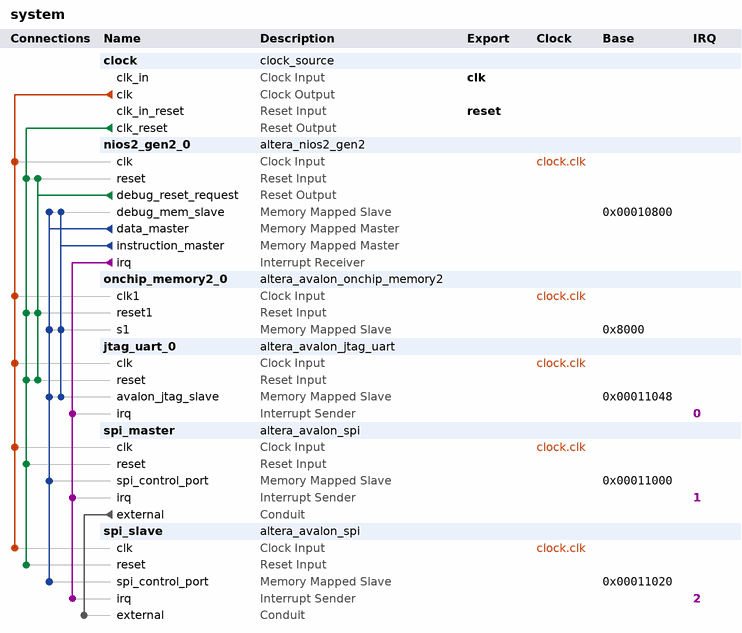
[diagram p0: system contents]
# Platform Designer (Qsys) system system, Cyclone IV E EP4CE115F29C7
# Parameters at their usual value, and those the tool derives, are not listed.
package require -exact qsys 18.1
create_system system
set_project_property DEVICE_FAMILY {Cyclone IV E}
set_project_property DEVICE EP4CE115F29C7

add_instance clock clock_source 18.1
set_instance_parameter_value clock clockFrequency 50000000

add_instance nios2_gen2_0 altera_nios2_gen2 18.1
set_instance_parameter_value nios2_gen2_0 dcache_size 2048
set_instance_parameter_value nios2_gen2_0 exceptionSlave onchip_memory2_0.s1
set_instance_parameter_value nios2_gen2_0 icache_size 4096
set_instance_parameter_value nios2_gen2_0 impl Tiny
set_instance_parameter_value nios2_gen2_0 resetSlave onchip_memory2_0.s1

add_instance onchip_memory2_0 altera_avalon_onchip_memory2 18.1
set_instance_parameter_value onchip_memory2_0 dataWidth 32
set_instance_parameter_value onchip_memory2_0 dualPort false
set_instance_parameter_value onchip_memory2_0 initMemContent true
set_instance_parameter_value onchip_memory2_0 initializationFileName onchip_mem.hex
set_instance_parameter_value onchip_memory2_0 memorySize 32768

add_instance jtag_uart_0 altera_avalon_jtag_uart 18.1
set_instance_parameter_value jtag_uart_0 simInteractiveOptions NO_INTERACTIVE_WINDOWS

add_instance spi_master altera_avalon_spi 18.1
set_instance_parameter_value spi_master clockPhase 1
set_instance_parameter_value spi_master clockPolarity 1
set_instance_parameter_value spi_master dataWidth 8
set_instance_parameter_value spi_master masterSPI true
set_instance_parameter_value spi_master numberOfSlaves 1
set_instance_parameter_value spi_master targetClockRate 128000

add_instance spi_slave altera_avalon_spi 18.1
set_instance_parameter_value spi_slave clockPhase 1
set_instance_parameter_value spi_slave clockPolarity 1
set_instance_parameter_value spi_slave dataWidth 8
set_instance_parameter_value spi_slave insertSync true
set_instance_parameter_value spi_slave masterSPI false
set_instance_parameter_value spi_slave numberOfSlaves 1
set_instance_parameter_value spi_slave targetClockRate 128000

# connections
add_connection clock.clk jtag_uart_0.clk clock
add_connection clock.clk nios2_gen2_0.clk clock
add_connection clock.clk onchip_memory2_0.clk1 clock
add_connection clock.clk spi_master.clk clock
add_connection clock.clk spi_slave.clk clock
add_connection clock.clk_reset jtag_uart_0.reset reset
add_connection clock.clk_reset nios2_gen2_0.reset reset
add_connection clock.clk_reset onchip_memory2_0.reset1 reset
add_connection clock.clk_reset spi_master.reset reset
add_connection clock.clk_reset spi_slave.reset reset
add_connection nios2_gen2_0.debug_reset_request jtag_uart_0.reset reset
add_connection nios2_gen2_0.debug_reset_request nios2_gen2_0.reset reset
add_connection nios2_gen2_0.debug_reset_request onchip_memory2_0.reset1 reset
add_connection nios2_gen2_0.data_master jtag_uart_0.avalon_jtag_slave avalon
set_connection_parameter_value nios2_gen2_0.data_master/jtag_uart_0.avalon_jtag_slave baseAddress 0x00011048
add_connection nios2_gen2_0.data_master nios2_gen2_0.debug_mem_slave avalon
set_connection_parameter_value nios2_gen2_0.data_master/nios2_gen2_0.debug_mem_slave baseAddress 0x00010800
add_connection nios2_gen2_0.data_master onchip_memory2_0.s1 avalon
set_connection_parameter_value nios2_gen2_0.data_master/onchip_memory2_0.s1 baseAddress 0x8000
add_connection nios2_gen2_0.data_master spi_master.spi_control_port avalon
set_connection_parameter_value nios2_gen2_0.data_master/spi_master.spi_control_port baseAddress 0x00011000
add_connection nios2_gen2_0.data_master spi_slave.spi_control_port avalon
set_connection_parameter_value nios2_gen2_0.data_master/spi_slave.spi_control_port baseAddress 0x00011020
add_connection nios2_gen2_0.instruction_master jtag_uart_0.avalon_jtag_slave avalon
set_connection_parameter_value nios2_gen2_0.instruction_master/jtag_uart_0.avalon_jtag_slave baseAddress 0x00011048
add_connection nios2_gen2_0.instruction_master nios2_gen2_0.debug_mem_slave avalon
set_connection_parameter_value nios2_gen2_0.instruction_master/nios2_gen2_0.debug_mem_slave baseAddress 0x00010800
add_connection nios2_gen2_0.instruction_master onchip_memory2_0.s1 avalon
set_connection_parameter_value nios2_gen2_0.instruction_master/onchip_memory2_0.s1 baseAddress 0x8000
add_connection spi_master.external spi_slave.external conduit
add_connection nios2_gen2_0.irq jtag_uart_0.irq interrupt
set_connection_parameter_value nios2_gen2_0.irq/jtag_uart_0.irq irqNumber 0
add_connection nios2_gen2_0.irq spi_master.irq interrupt
set_connection_parameter_value nios2_gen2_0.irq/spi_master.irq irqNumber 1
add_connection nios2_gen2_0.irq spi_slave.irq interrupt
set_connection_parameter_value nios2_gen2_0.irq/spi_slave.irq irqNumber 2

# exported interfaces
add_interface clk clock sink
set_interface_property clk EXPORT_OF clock.clk_in
add_interface reset reset sink
set_interface_property reset EXPORT_OF clock.clk_in_reset

set_interconnect_requirement {$system} qsys_mm.clockCrossingAdapter HANDSHAKE
set_interconnect_requirement {$system} qsys_mm.enableEccProtection FALSE
set_interconnect_requirement {$system} qsys_mm.insertDefaultSlave FALSE
set_interconnect_requirement {$system} qsys_mm.maxAdditionalLatency 1

save_system system.qsys
